# EAGLE design magpie (EAGLE 5.11)

## Sheet 1 of 2
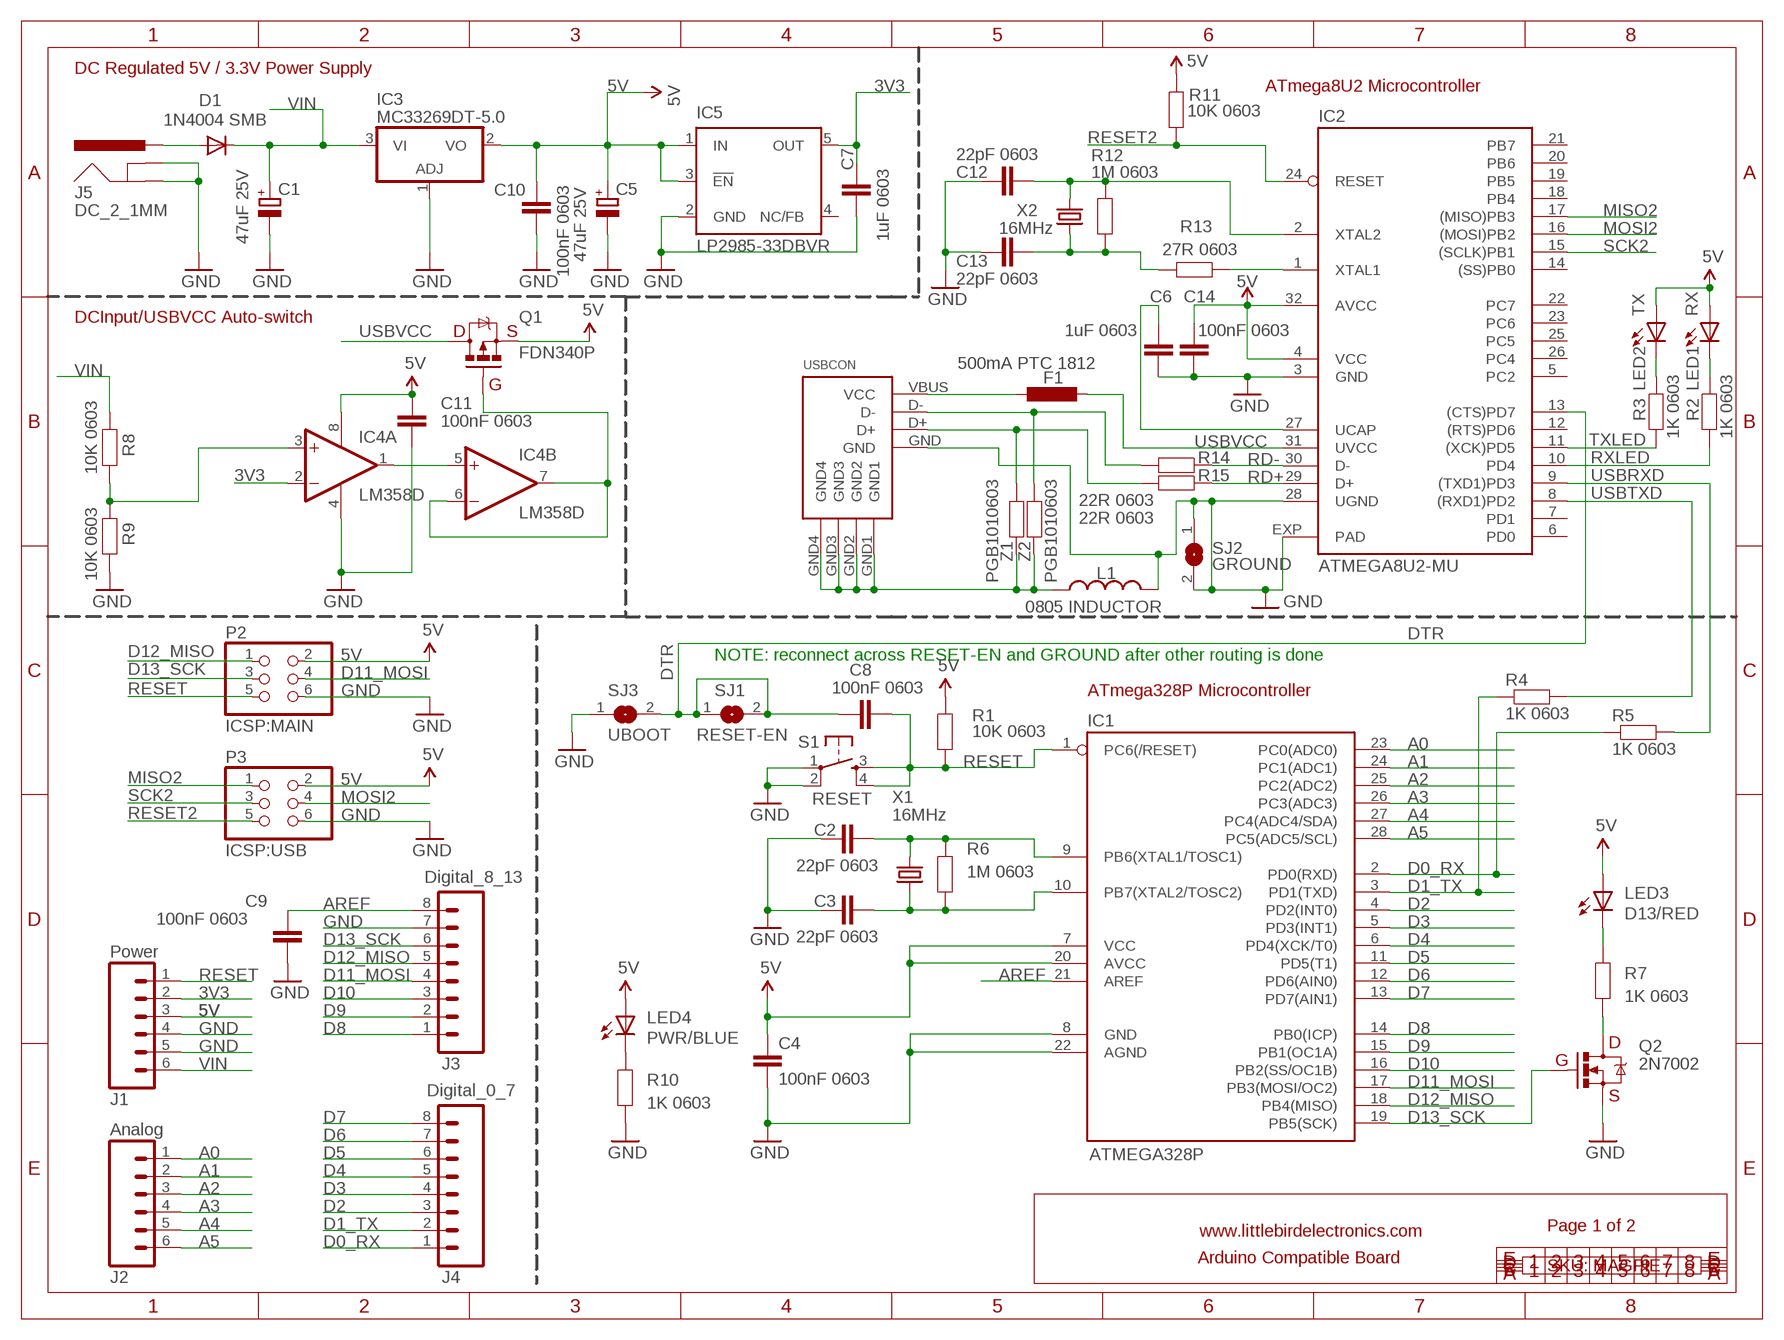
[diagram p0: schematic, sheet 1]

### Parts
C1  47uF 25V  CPOL-EUD  [PANASONIC_D]
C2  22pF 0603  CAP0603  [0603]
C3  22pF 0603  CAP0603  [0603]
C4  100nF 0603  CAP0603  [0603]
C5  47uF 25V  CPOL-EUD  [PANASONIC_D]
C6  1uF 0603  CAP0603  [0603]
C7  1uF 0603  CAP0603  [0603]
C8  100nF 0603  CAP0603  [0603]
C9  100nF 0603  CAP0603  [0603]
C10  100nF 0603  CAP0603  [0603]
C11  100nF 0603  CAP0603  [0603]
C12  22pF 0603  CAP0603  [0603]
C13  22pF 0603  CAP0603  [0603]
C14  100nF 0603  CAP0603  [0603]
D1  1N4004 SMB  DIODESMB  [SMB-DIODE]
F1  500mA PTC 1812  L-EUL1812  [L1812]
IC1  ATMEGA328P  AVR-MEGA8-P  [DIL28-3]
IC2  ATMEGA8U2-MU  ATMEL_ATMEGA8U2-MUQFN  [ATMEL_QFN32]
IC3  MC33269DT-5.0  MC33269D-5.0  [DPACK]
IC4  LM358D  [SO08]
IC5  LP2985-33DBVR  TEXAS_TPS77033  [TEXAS_SOT23-DBV]
J1  Power  M06SIP  [1X06]
J2  Analog  M06SIP  [1X06]
J3  Digital_8_13  M08  [1X08]
J4  Digital_0_7  M08  [1X08]
J5  DC_2_1MM  POWER_JACKPTH  [POWER_JACK_PTH]
L1  0805 INDUCTOR  INDUCTOR0805-LARGE  [0805-LARGE]
LED1  RX  LED0603  [LED-0603]
LED2  TX  LED0603  [LED-0603]
LED3  D13/RED  LED0603  [LED-0603]
LED4  PWR/BLUE  LED0603  [LED-0603]
P2  ICSP:MAIN  PINHD-2X3  [2X03]
P3  ICSP:USB  PINHD-2X3  [2X03]
Q1  FDN340P  MOSFET-PCHANNEL  [SOT23]
Q2  2N7002  MOSFET-NCHANNELSMD  [SOT23-3]
R1  10K 0603  RESISTOR0603  [0603]
R2  1K 0603  RESISTOR0603  [0603]
R3  1K 0603  RESISTOR0603  [0603]
R4  1K 0603  RESISTOR0603  [0603]
R5  1K 0603  RESISTOR0603  [0603]
R6  1M 0603  RESISTOR0603  [0603]
R7  1K 0603  RESISTOR0603  [0603]
R8  10K 0603  RESISTOR0603  [0603]
R9  10K 0603  RESISTOR0603  [0603]
R10  1K 0603  RESISTOR0603  [0603]
R11  10K 0603  RESISTOR0603  [0603]
R12  1M 0603  RESISTOR0603  [0603]
R13  27R 0603  RESISTOR0603  [0603]
R14  22R 0603  RESISTOR0603  [0603]
R15  22R 0603  RESISTOR0603  [0603]
S1  RESET  TAC_SWITCHSMD  [TACTILE_SWITCH_SMD]
SJ1  RESET-EN  SJ  [SJ]
SJ2  GROUND  SJ  [SJ]
SJ3  UBOOT  SJ  [SJ]
USBCON  CON_MOLEX_USB_MINI_BYOU_LONG  [YOU_LONG_MINI_USB_B]
X1  16MHz  CRYSTALHC49UV  [HC49U-V]
X2  16MHz  CRYSTALHC49UV  [HC49U-V]
Z1  PGB1010603  RESISTOR0603  [0603]
Z2  PGB1010603  RESISTOR0603  [0603]

### Nets
3V3: C7.2 IC4.2(A:-IN) IC5.5(OUT) J1.2
5V: C4.1 C5.+ C10.1 C11.1 C14.1 IC1.7(VCC) IC1.20(AVCC) IC2.4(VCC) IC2.32(AVCC) IC3.2(VO) IC4.8(P:V+) IC5.1(IN) IC5.3(!EN) J1.3 LED1.A LED2.A LED3.A LED4.A P2.2 P3.2 Q1.2(S) R1.2 R11.2 ; also sheet 2
A0: IC1.23(PC0(ADC0)) J2.1 ; also sheet 2
A1: IC1.24(PC1(ADC1)) J2.2 ; also sheet 2
A2: IC1.25(PC2(ADC2)) J2.3 ; also sheet 2
A3: IC1.26(PC3(ADC3)) J2.4 ; also sheet 2
A4: IC1.27(PC4(ADC4/SDA)) J2.5 ; also sheet 2
A5: IC1.28(PC5(ADC5/SCL)) J2.6 ; also sheet 2
AREF: C9.1 IC1.21(AREF) J3.8
D0_RX: IC1.2(PD0(RXD)) J4.1 R5.1 ; also sheet 2
D1_TX: IC1.3(PD1(TXD)) J4.2 R4.1 ; also sheet 2
D2: IC1.4(PD2(INT0)) J4.3 ; also sheet 2
D3: IC1.5(PD3(INT1)) J4.4 ; also sheet 2
D4: IC1.6(PD4(XCK/T0)) J4.5 ; also sheet 2
D5: IC1.11(PD5(T1)) J4.6 ; also sheet 2
D6: IC1.12(PD6(AIN0)) J4.7 ; also sheet 2
D7: IC1.13(PD7(AIN1)) J4.8 ; also sheet 2
D8: IC1.14(PB0(ICP)) J3.1 ; also sheet 2
D9: IC1.15(PB1(OC1A)) J3.2 ; also sheet 2
D10: IC1.16(PB2(SS/OC1B)) J3.3 ; also sheet 2
D11_MOSI: IC1.17(PB3(MOSI/OC2)) J3.4 P2.4 ; also sheet 2
D12_MISO: IC1.18(PB4(MISO)) J3.5 P2.1 ; also sheet 2
D13_SCK: IC1.19(PB5(SCK)) J3.6 P2.3 Q2.1(G)
DTR: C8.1 IC2.13((CTS)PD7) SJ1.1 SJ1.2 SJ3.2
GND: C1.- C2.1 C3.1 C4.2 C5.- C6.2 C7.1 C9.2 C10.2 C11.2 C12.1 C13.1 C14.2 IC1.8(GND) IC1.22(AGND) IC2.3(GND) IC2.28(UGND) IC2.EXP(PAD) IC3.1(ADJ) IC4.4(P:V-) IC5.2(GND) J1.4 J1.5 J3.7 J5.GND J5.GNDBREAK L1.2 P2.6 P3.6 Q2.2(S) R9.1 R10.1 S1.1 S1.2 SJ2.1 SJ2.2 SJ3.1 USBCON.GND ; also sheet 2
MISO2: IC2.17((MISO)PB3) P3.1
MOSI2: IC2.16((MOSI)PB2) P3.4
N$2: IC2.1(XTAL1) R13.1
N$3: L1.1 USBCON.GND1 USBCON.GND2 USBCON.GND3 USBCON.GND4 Z1.2 Z2.2
N$4: LED3.C R7.2
N$5: C2.2 IC1.9(PB6(XTAL1/TOSC1)) R6.2 X1.2
N$6: Q2.3(D) R7.1
N$7: C3.2 IC1.10(PB7(XTAL2/TOSC2)) R6.1 X1.1
N$8: D1.A J5.PWR
N$9: IC4.3(A:+IN) R8.1 R9.2
N$10: IC4.1(A:OUT) IC4.5(B:+IN)
N$11: LED1.C R2.2
N$12: IC4.6(B:-IN) IC4.7(B:OUT) Q1.1(G)
N$13: LED2.C R3.2
N$14: LED4.C R10.2
N$16: R15.2 USBCON.D+ Z1.1
N$17: R14.2 USBCON.D- Z2.1
N$113: C12.2 IC2.2(XTAL2) R12.2 X2.2
N$114: C13.2 R12.1 R13.2 X2.1
N$115: F1.1 USBCON.VBUS(VCC)
N$117: C6.1 IC2.27(UCAP)
RD+: IC2.29(D+) R15.1
RD-: IC2.30(D-) R14.1
RESET: C8.2 IC1.1(PC6(/RESET)) J1.1 P2.5 R1.1 S1.3 S1.4
RESET2: IC2.24(RESET) P3.5 R11.1
RXLED: IC2.10(PD4) R2.1
SCK2: IC2.15((SCLK)PB1) P3.3
TXLED: IC2.11((XCK)PD5) R3.1
USBRXD: IC2.9((TXD1)PD3) R5.2
USBTXD: IC2.8((RXD1)PD2) R4.2
USBVCC: F1.2 IC2.31(UVCC) Q1.3(D)
VIN: C1.+ D1.C IC3.3(VI) J1.6 R8.2
Unconnected: IC2.5(PC2) IC2.6(PD0) IC2.7(PD1) IC2.12((RTS)PD6) IC2.14((SS)PB0) IC2.18(PB4) IC2.19(PB5) IC2.20(PB6) IC2.21(PB7) IC2.22(PC7) IC2.23(PC6) IC2.25(PC5) IC2.26(PC4) IC5.4(NC/FB)

### Notes on the sheet
- DC Regulated 5V / 3.3V Power Supply
- ATmega8U2 Microcontroller
- DCInput/USBVCC Auto-switch
- D | S
- G
- NOTE: reconnect across RESET-EN and GROUND after other routing is done
- ATmega328P Microcontroller
- D
- G
- S
- Page 1 of 2
- www.littlebirdelectronics.com
- Arduino Compatible Board
- SKU: MAGPIE

## Sheet 2 of 2
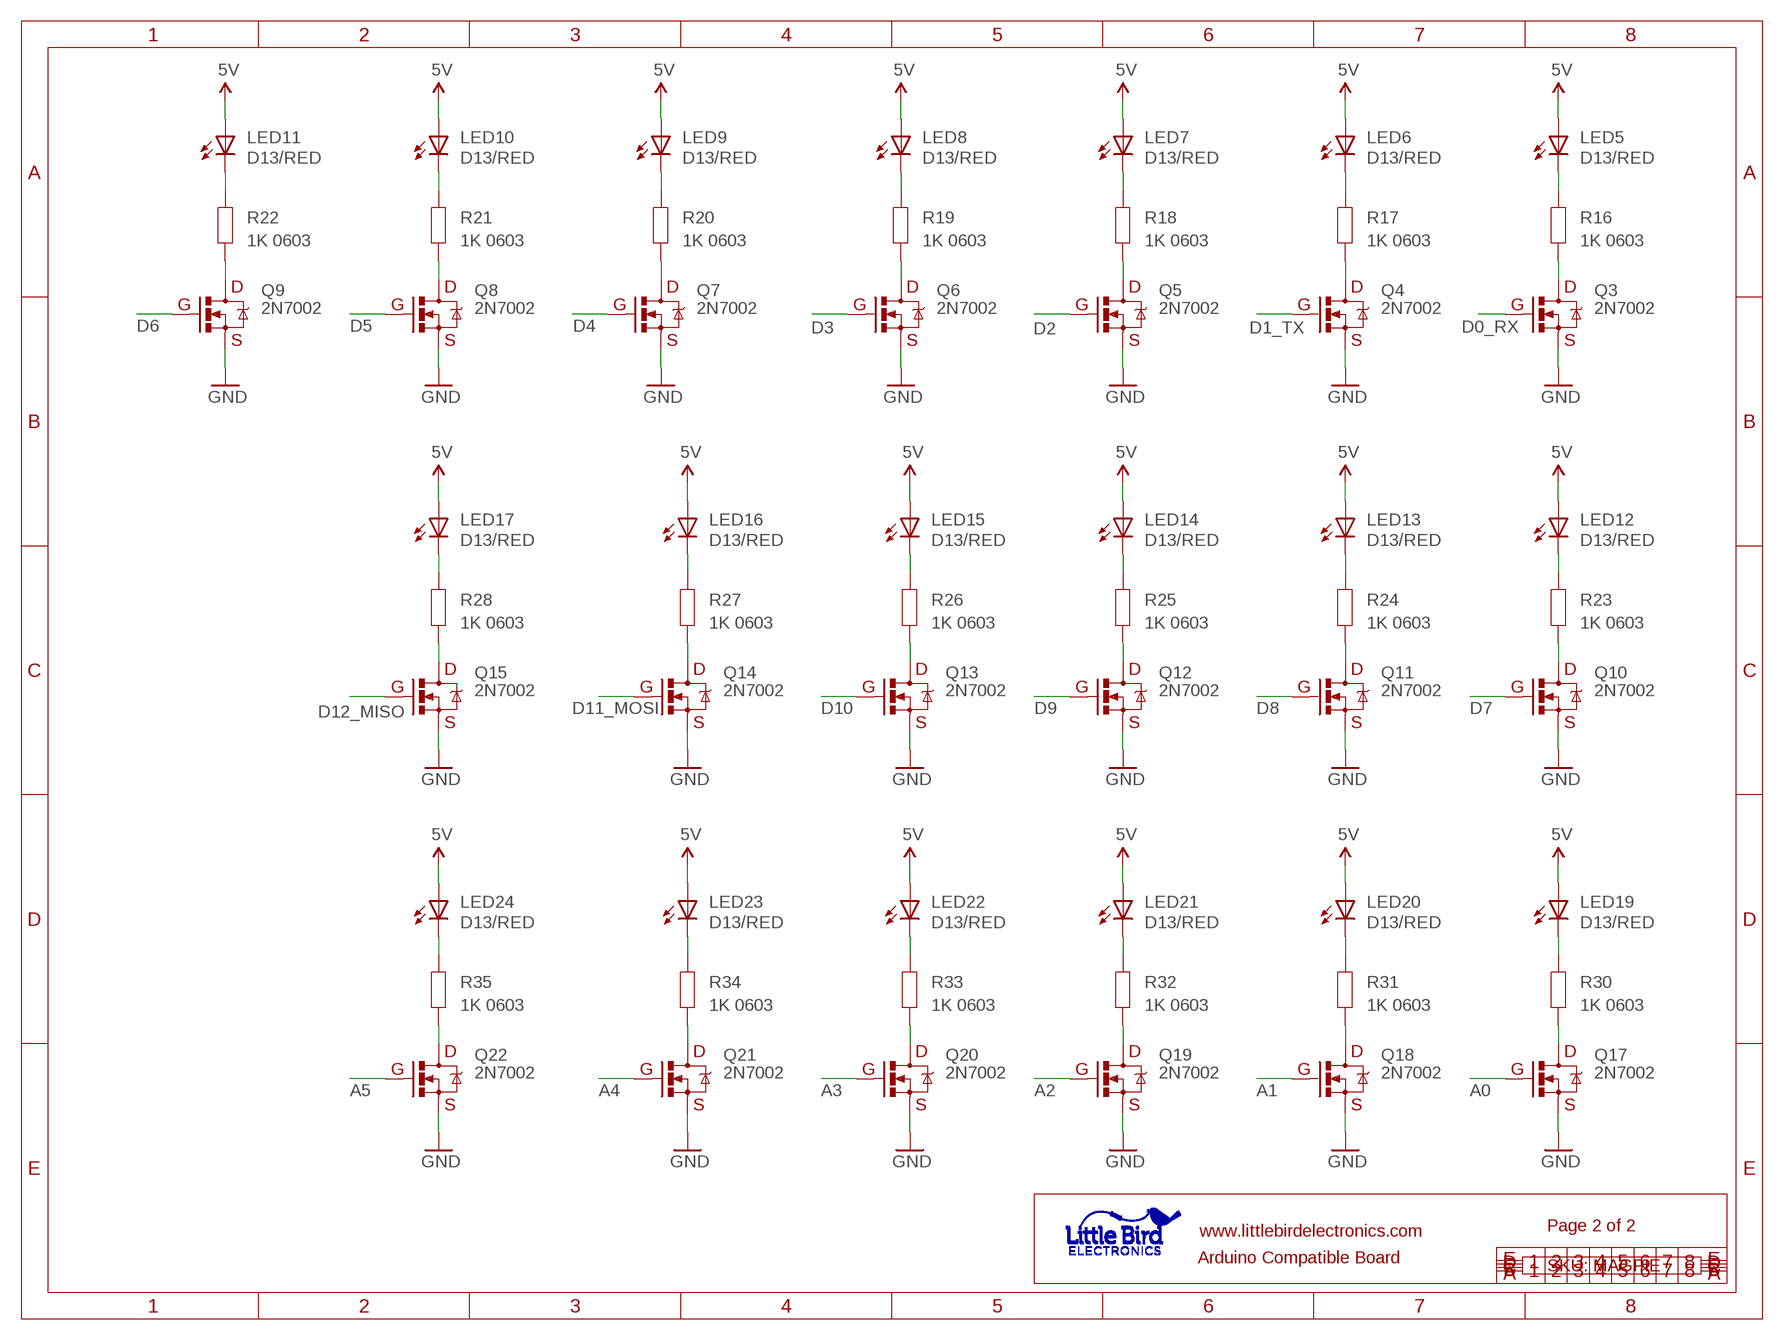
[diagram p1: schematic, sheet 2]

### Parts
LED5  D13/RED  LED0603  [LED-0603]
LED6  D13/RED  LED0603  [LED-0603]
LED7  D13/RED  LED0603  [LED-0603]
LED8  D13/RED  LED0603  [LED-0603]
LED9  D13/RED  LED0603  [LED-0603]
LED10  D13/RED  LED0603  [LED-0603]
LED11  D13/RED  LED0603  [LED-0603]
LED12  D13/RED  LED0603  [LED-0603]
LED13  D13/RED  LED0603  [LED-0603]
LED14  D13/RED  LED0603  [LED-0603]
LED15  D13/RED  LED0603  [LED-0603]
LED16  D13/RED  LED0603  [LED-0603]
LED17  D13/RED  LED0603  [LED-0603]
LED19  D13/RED  LED0603  [LED-0603]
LED20  D13/RED  LED0603  [LED-0603]
LED21  D13/RED  LED0603  [LED-0603]
LED22  D13/RED  LED0603  [LED-0603]
LED23  D13/RED  LED0603  [LED-0603]
LED24  D13/RED  LED0603  [LED-0603]
Q3  2N7002  MOSFET-NCHANNELSMD  [SOT23-3]
Q4  2N7002  MOSFET-NCHANNELSMD  [SOT23-3]
Q5  2N7002  MOSFET-NCHANNELSMD  [SOT23-3]
Q6  2N7002  MOSFET-NCHANNELSMD  [SOT23-3]
Q7  2N7002  MOSFET-NCHANNELSMD  [SOT23-3]
Q8  2N7002  MOSFET-NCHANNELSMD  [SOT23-3]
Q9  2N7002  MOSFET-NCHANNELSMD  [SOT23-3]
Q10  2N7002  MOSFET-NCHANNELSMD  [SOT23-3]
Q11  2N7002  MOSFET-NCHANNELSMD  [SOT23-3]
Q12  2N7002  MOSFET-NCHANNELSMD  [SOT23-3]
Q13  2N7002  MOSFET-NCHANNELSMD  [SOT23-3]
Q14  2N7002  MOSFET-NCHANNELSMD  [SOT23-3]
Q15  2N7002  MOSFET-NCHANNELSMD  [SOT23-3]
Q17  2N7002  MOSFET-NCHANNELSMD  [SOT23-3]
Q18  2N7002  MOSFET-NCHANNELSMD  [SOT23-3]
Q19  2N7002  MOSFET-NCHANNELSMD  [SOT23-3]
Q20  2N7002  MOSFET-NCHANNELSMD  [SOT23-3]
Q21  2N7002  MOSFET-NCHANNELSMD  [SOT23-3]
Q22  2N7002  MOSFET-NCHANNELSMD  [SOT23-3]
R16  1K 0603  RESISTOR0603  [0603]
R17  1K 0603  RESISTOR0603  [0603]
R18  1K 0603  RESISTOR0603  [0603]
R19  1K 0603  RESISTOR0603  [0603]
R20  1K 0603  RESISTOR0603  [0603]
R21  1K 0603  RESISTOR0603  [0603]
R22  1K 0603  RESISTOR0603  [0603]
R23  1K 0603  RESISTOR0603  [0603]
R24  1K 0603  RESISTOR0603  [0603]
R25  1K 0603  RESISTOR0603  [0603]
R26  1K 0603  RESISTOR0603  [0603]
R27  1K 0603  RESISTOR0603  [0603]
R28  1K 0603  RESISTOR0603  [0603]
R30  1K 0603  RESISTOR0603  [0603]
R31  1K 0603  RESISTOR0603  [0603]
R32  1K 0603  RESISTOR0603  [0603]
R33  1K 0603  RESISTOR0603  [0603]
R34  1K 0603  RESISTOR0603  [0603]
R35  1K 0603  RESISTOR0603  [0603]
U$5  LITTLEBIRDLOGO_SMALL  [LITTLEBIRD_LOGO_SMALL]

### Nets
5V: LED5.A LED6.A LED7.A LED8.A LED9.A LED10.A LED11.A LED12.A LED13.A LED14.A LED15.A LED16.A LED17.A LED19.A LED20.A LED21.A LED22.A LED23.A LED24.A ; also sheet 1
A0: Q17.1(G) ; also sheet 1
A1: Q18.1(G) ; also sheet 1
A2: Q19.1(G) ; also sheet 1
A3: Q20.1(G) ; also sheet 1
A4: Q21.1(G) ; also sheet 1
A5: Q22.1(G) ; also sheet 1
D0_RX: Q3.1(G) ; also sheet 1
D1_TX: Q4.1(G) ; also sheet 1
D2: Q5.1(G) ; also sheet 1
D3: Q6.1(G) ; also sheet 1
D4: Q7.1(G) ; also sheet 1
D5: Q8.1(G) ; also sheet 1
D6: Q9.1(G) ; also sheet 1
D7: Q10.1(G) ; also sheet 1
D8: Q11.1(G) ; also sheet 1
D9: Q12.1(G) ; also sheet 1
D10: Q13.1(G) ; also sheet 1
D11_MOSI: Q14.1(G) ; also sheet 1
D12_MISO: Q15.1(G) ; also sheet 1
GND: Q3.2(S) Q4.2(S) Q5.2(S) Q6.2(S) Q7.2(S) Q8.2(S) Q9.2(S) Q10.2(S) Q11.2(S) Q12.2(S) Q13.2(S) Q14.2(S) Q15.2(S) Q17.2(S) Q18.2(S) Q19.2(S) Q20.2(S) Q21.2(S) Q22.2(S) ; also sheet 1
N$1: LED5.C R16.2
N$54: LED6.C R17.2
N$55: Q4.3(D) R17.1
N$57: LED7.C R18.2
N$58: Q5.3(D) R18.1
N$60: LED8.C R19.2
N$61: Q6.3(D) R19.1
N$116: Q3.3(D) R16.1
N$118: LED9.C R20.2
N$119: Q7.3(D) R20.1
N$120: LED10.C R21.2
N$121: Q8.3(D) R21.1
N$122: LED11.C R22.2
N$123: Q9.3(D) R22.1
N$124: LED12.C R23.2
N$125: Q10.3(D) R23.1
N$126: LED13.C R24.2
N$127: Q11.3(D) R24.1
N$128: LED14.C R25.2
N$129: Q12.3(D) R25.1
N$130: LED15.C R26.2
N$131: Q13.3(D) R26.1
N$132: LED16.C R27.2
N$133: Q14.3(D) R27.1
N$134: LED17.C R28.2
N$135: Q15.3(D) R28.1
N$138: LED19.C R30.2
N$139: Q17.3(D) R30.1
N$140: LED20.C R31.2
N$141: Q18.3(D) R31.1
N$142: LED21.C R32.2
N$143: Q19.3(D) R32.1
N$144: LED22.C R33.2
N$145: Q20.3(D) R33.1
N$146: LED23.C R34.2
N$147: Q21.3(D) R34.1
N$148: LED24.C R35.2
N$149: Q22.3(D) R35.1

### Notes on the sheet
- D | D | D | D | D | D | D
- G | G | G | G | G | G | G
- S | S | S | S | S | S | S
- D | D | D | D | D | D
- G | G | G | G | G | G
- S | S | S | S | S | S
- D | D | D | D | D | D
- G | G | G | G | G | G
- S | S | S | S | S | S
- Page 2 of 2
- www.littlebirdelectronics.com
- Arduino Compatible Board
- SKU: MAGPIE

## Library data of the parts
C1 C5 = rcl:CPOL-EU: POLARIZED CAPACITOR, European symbol
C2-C4 C6-C14 = freetronics:CAP: Capacitor Standard 0603 ceramic capacitor, and 0.1" leaded capacitor.
D1 = freetronics:DIODE: Diode These are standard reverse protection diodes and small signal diodes. SMA package can handle up to about 1A. SOD-323 can handle about 200mA. What the SOD-323 package when ordering, there are some mfgs out there that are 5-pin packages.
F1 = rcl:L-EU: INDUCTOR, European symbol
IC1 = freetronics:AVR-MEGA8-P: MICROCONTROLLER 8 Kbytes FLASH 1 kbytes SRAM 512 bytes EEPROM USART 4-channel 10 bit ADC 2-channel 8 bit ADC
IC2 = freetronics-jon:ATMEL_ATMEGA8U2-MU
IC3 = linear:MC33269?*: Adjustable Output Low Dropout Voltage Regulator 800 mA Source: http://www.onsemi.com/pub/Collateral/MC33269-D.PDF
IC4 = linear:LM358: OP AMP also LM158; LM258; LM2904 Source: http://cache.national.com/ds/LM/LM158.pdf
IC5 = freetronics-jon:TEXAS_TPS770*: ULTRALOW-POWER 50-mA LOW-DROPOUT LINEAR REGULATORS 50-mA Low-Dropout Regulator Source: http://focus.ti.com/lit/ds/symlink/tps77001.pdf
J1 J2 = freetronics:M06: Header 6 Standard 6-pin 0.1" header. Use with straight break away headers (SKU : PRT-00116), right angle break away headers (PRT-00553), swiss pins (PRT-00743), machine pins (PRT-00117), and female headers (PRT-00115). Molex polarized connector foot print use with SKU : PRT-08094 with associated crimp pins and housings. NOTES ON THE VARIANTS LOCK and LOCK_LONGPADS... This footprint was designed to help hold the alignment of a through-hole component (i.e. 6-pin header) while soldering it into place. You may notice that each hole has been shifted either up or down by 0.005 of an inch from it's more standard position (which is a perfectly straight line). This slight alteration caused the pins (the squares in the middle) to touch the edges of the holes. Because they are alternating, it causes a "brace" to hold the component in place. 0.005 has proven to be the perfect amount of "off-center" position when using our standard breakaway headers. Although looks a little odd when you look at the bare footprint, once you have a header in there, the alteration is very hard to notice. Also, if you push a header all the way into place, it is covered up entirely on the bottom side. This idea of altering the position of holes to aid alignment will be further integrated into the Sparkfun Library for other footprints. It can help hold any component with 3 or more connection pins.
J3 J4 = freetronics:M08: Header 8 Standard 8-pin 0.1" header. Use with straight break away headers (SKU : PRT-00116), right angle break away headers (PRT-00553), swiss pins (PRT-00743), machine pins (PRT-00117), and female headers (PRT-00115).
J5 = freetronics:POWER_JACK: Power Jack This is the standard 5.5mm barrel jack for power. The PTH is the most common, proven, reliable, footprint. All others are experimental. The Slot footprint only works if the mill layer is transmitted to the PCB fab house so be warned. Spark Fun Electronics SKU : PRT-00119. Mating wall wart : TOL-00298 (and others)
L1 = freetronics-master-v1:INDUCTOR: Inductors Basic Inductor/Choke - 0603 and 1206. Footprints are not proven and vary greatly between part numbers.
LED1-LED17 LED19-LED24 = freetronics:LED: LEDs Standard schematic elements and footprints for 5mm, 3mm, 1206, and 0603 sized LEDs. 5mm - Spark Fun Electronics SKU : COM-00529 (and others)
P2 P3 = pinhead:PINHD-2X3: PIN HEADER
Q1 = freetronics-master-v1:MOSFET-PCHANNEL
Q2-Q15 Q17-Q22 = freetronics:MOSFET-NCHANNEL
R1-R28 R30-R35 Z1 Z2 = freetronics:RESISTOR: Resistor Basic schematic elements and footprints for 0603, 1206, and PTH 1/10th watt (small) resistors.
S1 = freetronics:TAC_SWITCH: Momentary Switch Button commonly used for reset or general input. Spark Fun Electronics SKU : COM-00097
SJ1-SJ3 = jumper:SJ: SMD solder JUMPER
U$5 = Monkey:LITTLEBIRDLOGO_SMALL
USBCON = Monkey:CON_MOLEX_USB_MINI_B
X1 X2 = freetronics-master-v1:CRYSTAL: Crystals Various standard crystals. Proven footprints. Spark Fun Electronics SKU : COM-00534

## Board
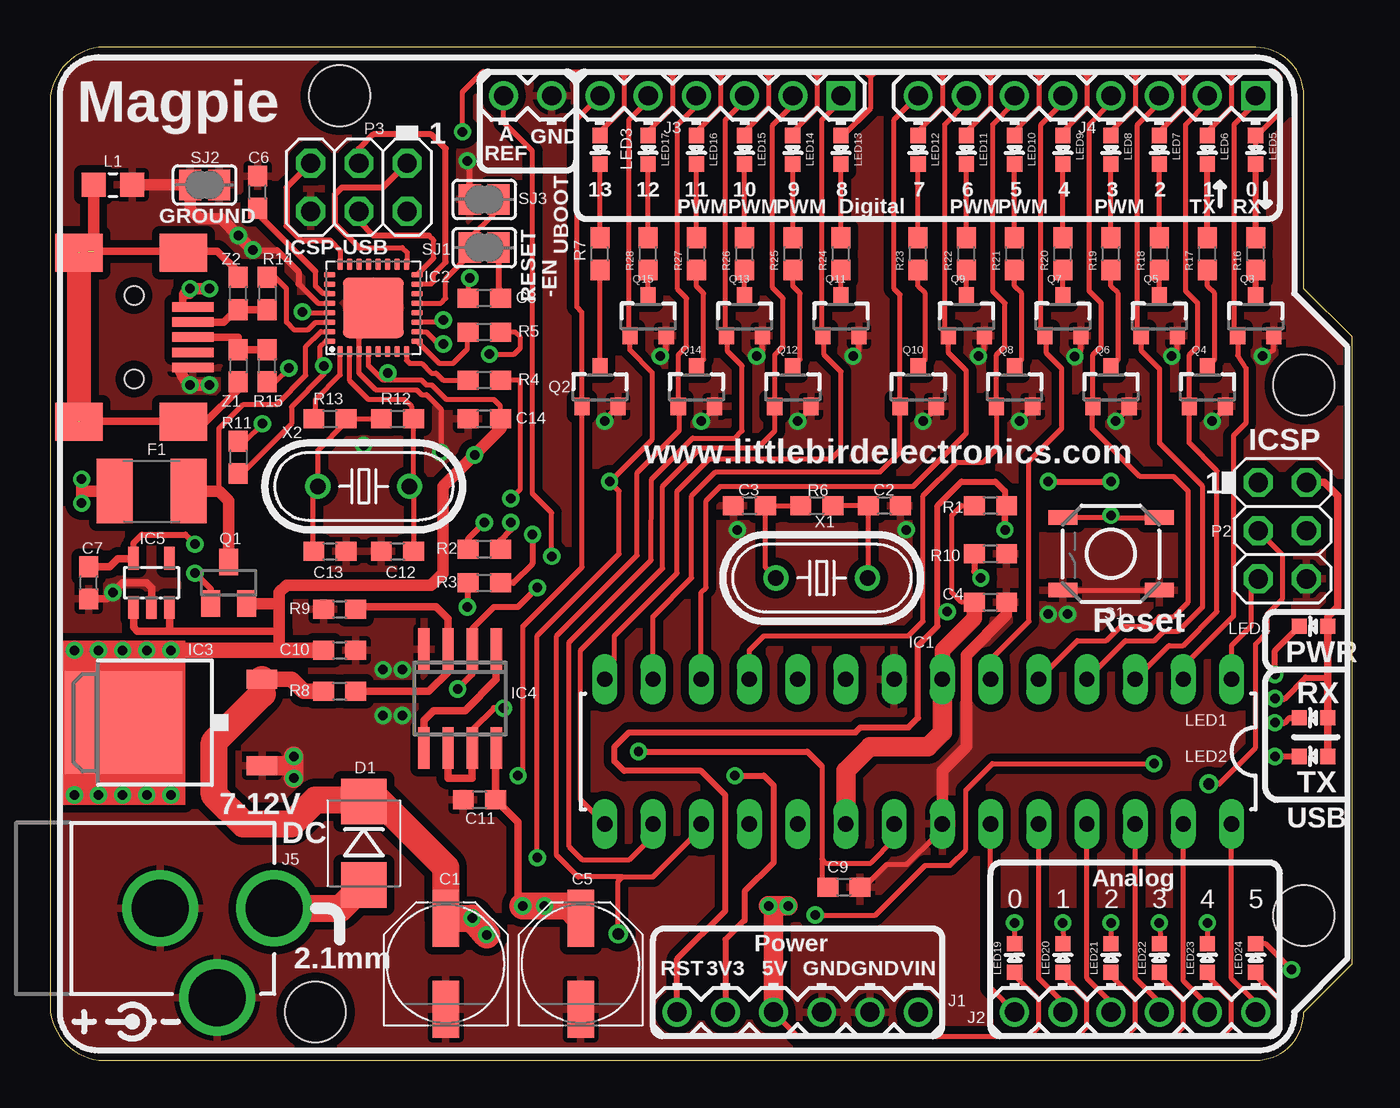
[diagram p2: board, top side]
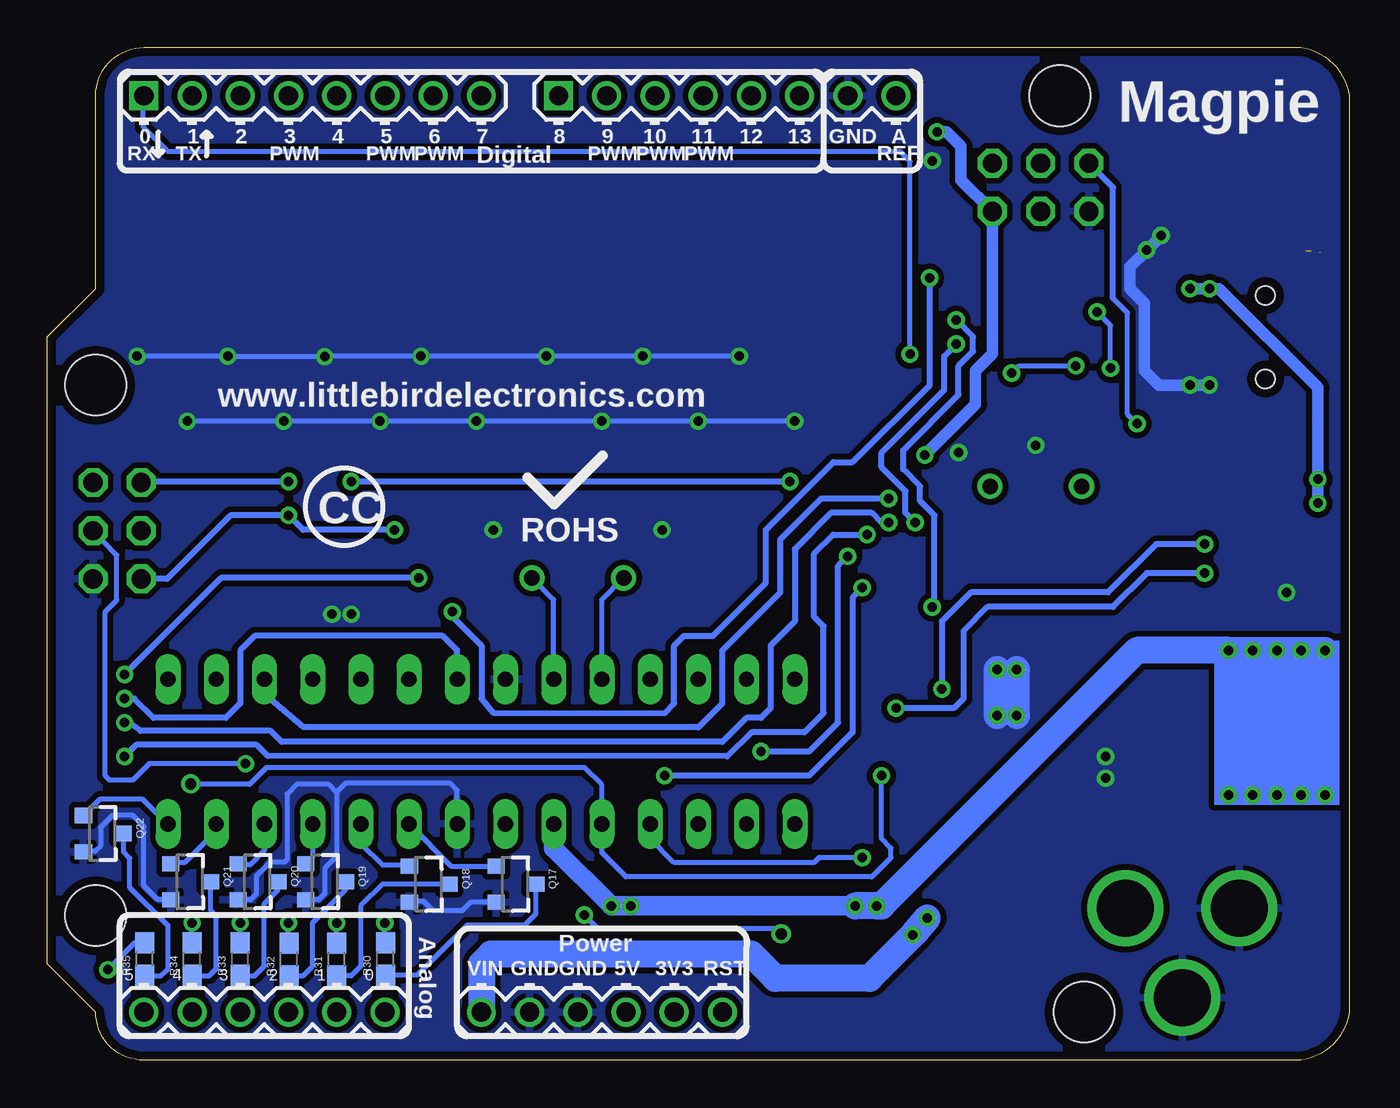
[diagram p3: board, bottom side, seen from below]

Size 68.58 x 53.34 mm. Coordinates in mm from the lower left corner, seen from the top.
Outline: 0,2.54 arc74 2.54,0 63.5,0 arc90 66.04,2.54 68.58,5.08 68.58,38.1 66.04,40.64 66.04,50.8 arc90 63.5,53.34 2.54,53.34 arc74 0,50.8 0,2.54
Copper layers (1*16): Top 0.035mm / dielectric 1.5mm / Bottom 0.035mm
Design rules "default *": minimum track width 10mil, minimum drill 18mil, track to track 10mil, track to pad 10mil, pad to pad 10mil, via to via 10mil, smd to smd 8mil, copper to edge 18mil, drill to drill 8mil, minimum pad ring 10mil, minimum via ring 8mil, stop-mask expansion 4mil, vias tented up to drill 25mil, thermal gap 10mil
Holes 3.2 mm at 66.04,35.56 66.04,7.62 15.24,50.8 13.97,2.54

### Footprints (pad centres in the part's own frame; a part is rotated, then mirrored left to right if it is on the bottom)
PANASONIC_D = smd 3 x 1.4: + 2.4,0; - -2.4,0
0603 = smd 1.1 x 1: 1 -0.85,0; 2 0.85,0
SMB-DIODE = smd 2.4 x 2.4: A 2.2,0; C -2.2,0
L1812 = smd 1.9 x 3.4: 1 -1.95,0; 2 1.95,0
DIL28-3 = drill 0.813 long: 1 -16.51,-3.81; 2 -13.97,-3.81; 3 -11.43,-3.81; 4 -8.89,-3.81; 5 -6.35,-3.81; 6 -3.81,-3.81; 7 -1.27,-3.81; 8 1.27,-3.81; 9 3.81,-3.81; 10 6.35,-3.81; 11 8.89,-3.81; 12 11.43,-3.81; 13 13.97,-3.81; 14 16.51,-3.81; 15 16.51,3.81; 16 13.97,3.81; 17 11.43,3.81; 18 8.89,3.81; 19 6.35,3.81; 20 3.81,3.81; 21 1.27,3.81; 22 -1.27,3.81; 23 -3.81,3.81; 24 -6.35,3.81; 25 -8.89,3.81; 26 -11.43,3.81; 27 -13.97,3.81; 28 -16.51,3.81
ATMEL_QFN32 = smd 0.6 x 0.3: 1 -2.3,1.75; 2 -2.3,1.25; 3 -2.3,0.75; 4 -2.3,0.25; 5 -2.3,-0.25; 6 -2.3,-0.75; 7 -2.3,-1.25; 8 -2.3,-1.75; 17 2.3,-1.75; 18 2.3,-1.25; 19 2.3,-0.75; 20 2.3,-0.25; 21 2.3,0.25; 22 2.3,0.75; 23 2.3,1.25; 24 2.3,1.75 | smd 0.3 x 0.6: 9 -1.75,-2.3; 10 -1.25,-2.3; 11 -0.75,-2.3; 12 -0.25,-2.3; 13 0.25,-2.3; 14 0.75,-2.3; 15 1.25,-2.3; 16 1.75,-2.3; 25 1.75,2.3; 26 1.25,2.3; 27 0.75,2.3; 28 0.25,2.3; 29 -0.25,2.3; 30 -0.75,2.3; 31 -1.25,2.3; 32 -1.75,2.3 | smd 3.2 x 3.2: EXP 0,0
DPACK = smd 1 x 1.6: 1 -2.28,-4.8; 3 2.28,-4.8 | smd 5.4 x 6.2: 2 0,2.5
SO08 = smd 0.6 x 2.2: 1 -1.905,-2.6; 2 -0.635,-2.6; 3 0.635,-2.6; 4 1.905,-2.6; 5 1.905,2.6; 6 0.635,2.6; 7 -0.635,2.6; 8 -1.905,2.6
TEXAS_SOT23-DBV = smd 0.55 x 1.2: 1 -0.95,-1.3; 2 0,-1.3; 3 0.95,-1.3; 4 0.95,1.3; 5 -0.95,1.3
1X06 = drill 1.016 round: 1 0,0; 2 2.54,0; 3 5.08,0; 4 7.62,0; 5 10.16,0; 6 12.7,0
1X08 = drill 1.016 square: 1 0,0 | drill 1.016 round: 2 2.54,0; 3 5.08,0; 4 7.62,0; 5 10.16,0; 6 12.7,0; 7 15.24,0; 8 17.78,0
POWER_JACK_PTH = drill 2.997 round: GND 0,7.7; GNDBREAK 4.7,10.7; PWR 0,13.7
0805-LARGE = smd 1.27 x 1.27: 1 -1.016,0; 2 1.016,0
LED-0603 = smd 0.8 x 0.8: A 0,-0.75; C 0,0.75
2X03 = drill 1.016 octagon: 1 -2.54,-1.27; 2 -2.54,1.27; 3 0,-1.27; 4 0,1.27; 5 2.54,-1.27; 6 2.54,1.27
SOT23 = smd 1 x 1.4: 1 -0.95,-1.1; 2 0.95,-1.1; 3 0,1.1
SOT23-3 = smd 0.8 x 0.9: 1 -0.95,-1; 2 0.95,-1; 3 0,1.1
TACTILE_SWITCH_SMD = smd 1.524 x 0.762: 1 -2.54,1.905; 2 2.54,1.905; 3 -2.54,-1.905; 4 2.54,-1.905
SJ = smd 1.168 x 1.6: 1 -0.762,0; 2 0.762,0
YOU_LONG_MINI_USB_B = smd 0.5 x 2.2: D+ 4.45,6; D- 3.65,6; GND 6.05,6; ID 5.25,6; VBUS 2.85,6 | smd 2 x 2.5: GND1 8.9,0; GND2 8.9,5.5; GND3 0,0; GND4 0,5.5 | hole 1: 2.25,2.9; 6.65,2.9
HC49U-V = drill 0.813 round: 1 -2.413,0; 2 2.413,0

### Placement (x,y rotation side)
C1  20.83,5.08 90 top
C2  43.94,29.21 180 top
C3  36.83,29.21 0 top
C4  49.53,24.13 0 top
C5  27.94,5.08 90 top
C6  10.92,45.72 90 top
C7  2.03,25.15 90 top
C8  22.86,40.13 180 top
C9  41.81,9.12 0 top
C10  15.24,21.59 0 top
C11  22.61,13.72 180 top
C12  18.29,26.8 0 top
C13  14.73,26.8 180 top
C14  22.86,33.78 180 top
D1  16.51,11.43 270 top
F1  5.33,29.97 0 top
IC1  45.72,16.26 180 top
IC2  17.02,39.62 90 top
IC3  6.35,17.78 90 top
IC4  21.59,19.05 180 top
IC5  5.33,25.15 0 top
J1  33.02,2.54 0 top
J2  50.8,2.54 0 top
J3  41.66,50.8 180 top
J4  63.5,50.8 180 top
J5  -1.91,8 270 top
L1  3.3,46.1 0 top
LED1  66.55,18.03 90 top
LED2  66.55,16 90 top
LED3  28.96,47.96 180 top
LED4  66.55,22.86 90 top
LED5  63.5,47.96 180 top
LED6  60.96,47.96 180 top
LED7  58.42,47.96 180 top
LED8  55.88,47.96 180 top
LED9  53.34,47.96 180 top
LED10  50.8,47.96 180 top
LED11  48.26,47.96 180 top
LED12  45.72,47.96 180 top
LED13  41.66,47.96 180 top
LED14  39.12,47.96 180 top
LED15  36.58,47.96 180 top
LED16  34.04,47.96 180 top
LED17  31.5,47.96 180 top
LED19  50.8,5.38 0 top
LED20  53.34,5.38 0 top
LED21  55.88,5.38 0 top
LED22  58.42,5.38 0 top
LED23  60.96,5.38 0 top
LED24  63.5,5.38 0 top
P2  64.91,27.89 270 top
P3  16.26,45.97 180 top
Q1  9.4,25.15 0 top
Q2  28.96,35.43 0 top
Q3  63.5,39.17 0 top
Q4  60.96,35.43 0 top
Q5  58.42,39.17 0 top
Q6  55.88,35.43 0 top
Q7  53.34,39.17 0 top
Q8  50.8,35.43 0 top
Q9  48.26,39.17 0 top
Q10  45.72,35.43 0 top
Q11  41.66,39.17 0 top
Q12  39.12,35.43 0 top
Q13  36.58,39.17 0 top
Q14  34.04,35.43 0 top
Q15  31.5,39.17 0 top
Q17  43.95,9.27 270 bottom
Q18  48.51,9.27 270 bottom
Q19  53.98,9.4 270 bottom
Q20  57.53,9.4 270 bottom
Q21  61.09,9.4 270 bottom
Q22  65.68,11.94 270 bottom
R1  49.53,29.21 180 top
R2  22.86,26.92 0 top
R3  22.86,25.15 0 top
R4  22.86,35.81 180 top
R5  22.86,38.35 180 top
R6  40.39,29.21 0 top
R7  28.96,42.47 90 top
R8  15.24,19.43 180 top
R9  15.24,23.75 0 top
R10  49.53,26.67 180 top
R11  9.91,31.75 270 top
R12  18.29,33.78 0 top
R13  14.73,33.78 0 top
R14  11.43,40.39 270 top
R15  11.43,36.58 90 top
R16  63.5,42.47 90 top
R17  60.96,42.47 90 top
R18  58.42,42.47 90 top
R19  55.88,42.47 90 top
R20  53.34,42.47 90 top
R21  50.8,42.47 90 top
R22  48.26,42.47 90 top
R23  45.72,42.47 90 top
R24  41.66,42.47 90 top
R25  39.12,42.47 90 top
R26  36.58,42.47 90 top
R27  34.04,42.47 90 top
R28  31.5,42.47 90 top
R30  50.77,5.33 90 bottom
R31  53.34,5.31 90 bottom
R32  55.85,5.31 90 bottom
R33  58.42,5.33 90 bottom
R34  60.96,5.33 90 bottom
R35  63.45,5.33 90 bottom
S1  55.88,26.67 180 top
SJ1  22.86,42.8 0 top
SJ2  8.13,46.1 0 top
SJ3  22.86,45.34 0 top
U$5  53.31,37.62 0 bottom
USBCON  1.51,42.53 270 top
X1  40.64,25.4 0 top
X2  16.51,30.23 0 top
Z1  9.91,36.58 270 top
Z2  9.91,40.39 90 top

### Tracks (layer width: path | path; a pad name or v marks a point on that pad's centre or on a via)
3V3  (via drill 0.5)
  Top 0.305: J1.2 35.56,6.35 36.58,7.37 36.58,8.89 38.1,10.41 38.1,14.48 37.59,14.99 v36.07,14.99 | v25.65,24.89 24.64,23.88 23.37,23.88 22.23,22.73 IC4.2 22.23,20.32 v21.46,19.56 | IC5.5 4.38,27.24 4.83,27.69 7.11,27.69 v7.62,27.18
  Top 0.406: C7.2 3.14,26 3.56,26.42 4.35,26.42 IC5.5
  Bottom 0.305: v36.07,14.99 28.45,14.99 26.16,17.27 26.16,24.38 v25.65,24.89 | v7.62,27.18 10.16,27.18 12.7,24.64 19.94,24.64 21.46,23.11 v21.46,19.56
5V  (via drill 0.5)
  Top 0.254: R1.2 48.01,29.21 47.5,28.7 47.5,24.64 48.01,24.13 C4.1 | 17.78,35.81 19.56,35.81 19.81,35.56 20.11,35.56 20.87,34.8 23.37,34.8 23.71,34.46 C14.1 23.75,33.78 | 17.78,35.81 17.53,35.81 16.77,36.57 IC2.4 | IC2.32 14.51,37.87 14.22,37.59 14.22,36.75 v14.4,36.58 14.4,36.12 12.7,34.42 12.7,33.53 10.07,30.9 R11.2 | 17.78,35.81 v17.78,36.2 | 12.06,24.13 11.98,24.05 | LED3.A 28.96,48.9 30.23,50.16 30.23,51.82 | 30.23,51.82 29.97,52.07 22.78,52.07 21.72,51 v21.72,48.9 | LED17.A 31.5,48.9 32.77,50.16 32.77,51.82 | 32.77,51.82 32.51,52.07 30.48,52.07 30.23,51.82 | LED16.A 34.04,48.9 35.31,50.16 35.31,51.82 | 35.31,51.82 35.05,52.07 33.02,52.07 32.77,51.82 | LED15.A 36.58,48.9 37.85,50.16 37.85,51.82 | 37.85,51.82 37.59,52.07 35.56,52.07 35.31,51.82 | LED14.A 39.12,48.9 40.39,50.16 40.39,51.82 | 40.39,51.82 40.13,52.07 38.1,52.07 37.85,51.82 | LED13.A 41.8,48.7 43.2,50.11 43.2,51.79 | 43.2,51.79 42.93,52.07 40.64,52.07 40.39,51.82 | LED12.A 45.72,48.9 46.99,50.16 46.99,51.82 | 46.99,51.82 46.74,52.07 43.48,52.07 43.2,51.79 | LED11.A 48.26,48.9 49.53,50.16 49.53,51.82 | 49.53,51.82 49.28,52.07 47.24,52.07 46.99,51.82 | LED10.A 50.8,48.9 52.07,50.16 52.07,51.82 | 52.07,51.82 51.82,52.07 49.78,52.07 49.53,51.82 | LED9.A 53.34,48.9 54.61,50.16 54.61,51.82 | 54.61,51.82 54.36,52.07 52.32,52.07 52.07,51.82 | LED8.A 55.88,48.9 57.15,50.16 57.15,51.82 | 57.15,51.82 56.9,52.07 54.86,52.07 54.61,51.82 | LED7.A 58.42,48.9 59.69,50.16 59.69,51.82 | 59.69,51.82 59.44,52.07 57.4,52.07 57.15,51.82 | LED6.A 60.96,48.9 62.23,50.16 62.23,51.82 | 62.23,51.82 61.98,52.07 59.94,52.07 59.69,51.82 | 63.5,48.64 LED5.A
  Top 0.254: 63.5,48.64 63.5,48.26 | 63.5,48.64 64.77,49.91 64.77,51.82 64.52,52.07 62.48,52.07 62.23,51.82 | LED24.A 63.5,4.45 64.77,3.17 64.77,1.78 64.26,1.27 61.72,1.27 | 51.56,1.27 39.37,1.27 J1.3 | 51.56,1.27 54.1,1.27 | 54.1,1.27 56.64,1.27 | 56.64,1.27 59.18,1.27 | 59.18,1.27 61.72,1.27 | LED23.A 60.96,4.45 62.23,3.17 62.23,1.78 61.72,1.27 | LED22.A 58.42,4.45 59.69,3.17 59.69,1.78 59.18,1.27 | LED21.A 55.88,4.45 57.15,3.17 57.15,1.78 56.64,1.27 | LED20.A 53.34,4.45 54.61,3.17 54.61,1.78 54.1,1.27 | LED19.A 50.8,4.45 52.07,3.17 52.07,1.78 51.56,1.27
  Top 0.305: 67.3,20.15 66.12,20.15 65.02,19.05 v64.52,19.05
  Top 0.406: IC4.8 23.46,16.41 C11.1 24.64,12.53 24.64,8.38 v24.89,8.13 | LED2.A LED1.A 67.3,20.15 LED4.A 67.3,23.36 67.82,23.88 67.82,29.72 67.11,30.43 P2.2 | IC5.1 4.38,22.79 4.57,22.61 6.22,22.61 | 12.06,22.61 6.22,22.61 | IC5.3 6.28,22.67 6.22,22.61
  Top 0.61: 23.75,33.78 23.75,33.27 v22.35,31.88 20.7,30.23 20.7,25.65 20.07,25.02 12.45,25.02 12.06,24.64 12.06,24.13 12.06,22.61 12.06,21.59 | 11.98,24.05 Q1.2
  Top 0.813: v5.08,21.59 v6.35,21.59 12.06,21.59 C10.1 | IC1.7 46.99,21.59 48.68,23.28 C4.1
  Top 1.016: IC3.2 3.85,18.07 5.08,19.3 v5.08,21.59 | 38.1,8.13 J1.3 | v37.85,8.13 38.1,8.13 | v38.86,8.13 38.1,8.13 | IC1.20 41.91,15.24 43.18,16.51 46.23,16.51 46.99,17.27 IC1.7
  Top 1.422: C5.+ 27.29,8.13 v24.89,8.13
  Bottom 0.254: v14.4,36.58 17.4,36.58 v17.78,36.2
  Bottom 0.305: v64.52,19.05 64.01,19.05 62.99,18.03 59.18,18.03 58.42,18.8 58.42,21.59 57.66,22.35 47.75,22.35 46.99,21.59 IC1.7
  Bottom 0.61: v21.72,48.9 21.21,48.9 20.45,48.13 20.45,46.35 P3.2 18.8,37.21 19.68,36.32 19.68,34.54 v22.35,31.88
  Bottom 1.016: IC1.20 41.91,11.18 v38.86,8.13 v37.85,8.13 v26.04,8.13
  Bottom 1.422: v26.04,8.13 v24.89,8.13 24.64,8.13 11.18,21.59 v6.35,21.59 1.27,21.59
A0
  Top 0.254: IC1.23 49.53,3.81 J2.1
  Bottom 0.254: Q17.1 47.3,10.22 IC1.23
A1
  Top 0.254: J2.2 53.34,3.05 52.07,4.32 IC1.24
  Bottom 0.254: IC1.24 52.07,11.43 50.93,10.29 49.58,10.29 Q18.1
A2
  Top 0.254: J2.3 55.88,3.05 54.61,4.32 IC1.25
  Bottom 0.254: IC1.25 54.61,10.71 Q19.1
A3
  Top 0.254: J2.4 58.42,3.05 57.15,4.32 IC1.26
  Bottom 0.254: IC1.26 57.15,11.05 57.91,10.29 58.47,10.29 Q20.1
A4
  Top 0.254: J2.5 60.96,2.92 59.69,4.19 IC1.27
  Bottom 0.254: IC1.27 59.69,12.06 61.34,10.41 62.02,10.41 Q21.1
A5
  Top 0.254: IC1.28 62.23,4.32 63.5,3.05 J2.6
  Bottom 0.254: IC1.28 62.48,12.7 62.51,12.7 63.55,13.74 65.83,13.74 Q22.1
AREF  (via drill 0.5)
  Top 0.254: J3.8 23.88,49.4 25.4,47.88 25.4,29.84 26.42,28.83 v26.42,26.54 | 40.64,15.49 40.64,10.59 | 40.64,10.59 40.64,9.44 C9.1 | IC1.21 44.45,11.61 43.23,10.39 40.84,10.39 40.64,10.59
  Top 0.305: 40.64,15.49 39.88,16.26 v30.99,16.26
  Bottom 0.305: v30.99,16.26 28.45,16.26 26.92,17.78 26.92,26.04 v26.42,26.54
D0_RX  (via drill 0.5)
  Top 0.254: IC1.2 59.69,20.75 62.33,23.39 62.33,32.89 62.99,33.55 62.99,36.45 62.56,37.11 62.56,38.16 Q3.1 | 62.31,38.05 62.39,38.05 Q3.1 | J4.1 63.5,50.42 62.36,49.28 62.36,38.36 Q3.1 | R5.1 24.49,38.35 24.77,38.08 24.77,37.52 24.43,37.19 v23.14,37.19
  Bottom 0.254: v23.14,37.19 23.14,47.35 23.65,47.85 62.23,47.85 63.52,49.15 63.52,50.77 J4.1
D1_TX  (via drill 0.5)
  Top 0.254: IC1.3 58.93,21.84 59.69,21.84 61.47,23.62 61.47,31.04 59.99,32.51 59.99,34.42 Q4.1 60.01,37.15 60.45,37.59 60.45,39.88 59.82,40.51 59.82,49.28 60.96,50.42 J4.2 | v24.26,29.59 24.77,30.1 24.77,35.81 R4.1
  Bottom 0.305: v24.26,29.59 27.81,29.59 29.97,27.43 29.97,24.64 33.02,21.59 33.02,18.8 34.29,17.53 55.09,17.55 57.15,19.3 IC1.3
D2
  Top 0.254: IC1.4 56.64,22.1 58.17,22.1 58.67,22.61 59.44,22.61 60.71,23.88 60.71,30.23 58.45,32.49 58.45,36.4 57.48,37.36 57.48,38.16 Q5.1 | Q5.1 57.15,38.49 | J4.3 58.42,50.42 57.28,49.28 57.28,38.36 Q5.1
D3
  Top 0.254: IC1.5 54.1,22.1 55.63,22.1 56.39,22.86 57.91,22.86 58.42,23.37 59.18,23.37 59.94,24.13 59.94,29.97 59.18,30.73 57.4,30.73 54.89,33.25 54.89,34.39 Q6.1 54.93,37.15 55.37,37.59 55.37,39.88 54.74,40.51 54.74,49.28 55.88,50.42 J4.4
D4
  Top 0.254: IC1.6 49.53,21.08 51.56,23.11 51.56,31.55 53.29,33.27 53.29,36.42 52.48,37.24 52.48,38.08 Q7.1 52.2,38.36 52.2,49.28 53.34,50.42 J4.5
D5
  Top 0.254: IC1.11 36.83,21.59 37.59,22.35 45.21,22.35 45.97,23.11 45.97,29.72 47.75,31.5 49.15,31.5 49.86,32.21 Q8.1 49.85,37.15 50.29,37.59 50.29,39.88 49.66,40.51 49.66,49.28 50.8,50.42 J4.6
D6
  Top 0.254: IC1.12 34.29,24.64 34.54,24.89 34.54,29.46 35.31,30.23 45.47,30.23 48.26,33.02 48.26,36.32 47.32,37.26 47.32,38.16 Q9.1 | Q9.1 46.99,38.49 | J4.7 48.26,50.42 47.12,49.28 47.12,38.36 Q9.1
D7
  Top 0.254: IC1.13 31.75,23.37 33.78,25.4 33.78,29.72 35.05,30.99 43.71,30.99 44.76,32.03 44.76,34.42 Q10.1 44.77,40.32 44.45,40.64 44.45,49.53 J4.8
D8
  Top 0.254: IC1.14 29.21,20.57 29.72,21.08 29.72,22.35 33.02,25.65 33.02,29.97 34.72,31.67 41.15,31.67 41.66,32.18 41.66,36.27 40.77,37.16 40.77,38.11 Q11.1 40.64,38.23 40.64,49.53 41.66,50.55 J3.1
D9
  Top 0.254: IC1.15 27.94,13.72 27.94,21.59 32.26,25.91 32.26,30.23 34.29,32.26 37.29,32.26 38.18,33.15 Q12.1 38.17,37.15 38.61,37.59 38.61,40.13 38.05,40.69 38.05,49.25 39.01,50.22 39.01,50.7 J3.2
D10
  Top 0.254: J3.3 36.58,50.55 35.56,49.53 35.56,38.23 Q13.1 35.69,38.11 35.69,37.34 36.45,36.58 36.45,33.15 36.07,32.77 33.83,32.77 31.67,30.61 31.65,26.34 27.33,22.02 27.33,11.25 28.02,10.57 30.5,10.57 31.75,11.81 IC1.16
D11_MOSI  (via drill 0.5, 0.6)
  Top 0.254: 33.96,50.72 J3.4 33.98,50.75 33.98,50.22 33.05,49.28 33.05,40.62 33.53,40.13 33.53,37.59 33.09,37.15 Q14.1 33.15,34.37 33.15,33.17 30.91,30.94 30.91,26.59 26.67,22.35 26.67,10.79 27.81,9.65 30.15,9.65 | v58.14,15.62 49.63,15.62 48.23,14.22 48.23,11.1 47.4,10.26 46.09,10.26 43.48,7.65 v40.3,7.65 | IC1.17 34.29,12.19 31.75,9.65 30.15,9.65 | 30.15,9.65 29.92,9.42 v29.92,6.66
  Bottom 0.254: P2.4 64.92,26.61 64.92,24.23 65.53,23.62 65.53,14.99 65.3,14.76 64.08,14.76 63.22,15.62 v58.14,15.62 | 30.12,6.93 39.58,6.93 v40.3,7.65
  Bottom 0.305: v29.92,6.66 30.12,6.93
D12_MISO  (via drill 0.5)
  Top 0.254: v25.65,10.67 25.65,22.35 29.97,26.67 29.97,29.97 v29.46,30.48 29.49,30.48 31.73,32.72 31.73,36.22 30.53,37.41 30.53,38.15 Q15.1 30.48,38.23 30.48,49.53 31.5,50.55 J3.5
  Top 0.305: v52.58,30.48 v55.88,30.48
  Bottom 0.254: v25.65,10.67 27.94,10.67 28.19,10.41 35.56,10.41 36.83,11.68 IC1.18
  Bottom 0.305: P2.1 63.59,30.48 v55.88,30.48 | v29.46,30.48 v52.58,30.48
D13_SCK  (via drill 0.5, 0.6)
  Top 0.254: v24.64,14.99 24.89,15.24 24.89,22.86 28.02,25.98 Q2.1 28.01,39.41 27.74,39.67 27.74,49.58 J3.6 | v61.04,14.55 61.59,14.55 63.5,16.46 63.5,21.92 64.11,22.53 64.11,23.5 64.92,24.31 64.92,26.61 P2.3
  Bottom 0.254: v24.64,14.99 24.64,11.68 24.13,11.18 24.13,10.67 25.15,9.65 38.1,9.65 39.37,10.92 IC1.19 39.37,14.5 40.28,15.42 57.05,15.42 57.94,14.53 61.01,14.53 v61.04,14.55
DTR
  Top 0.254: IC2.13 20.57,39.88 20.83,40.13 20.83,41.15 22.1,42.42 SJ1.1 22.1,43.31 23.37,44.58 23.37,45.09 SJ3.2
  Top 0.305: C8.1 23.62,40.73 SJ1.2
  Top 0.61: SJ1.1 SJ1.2
GND  (via drill 0.5)
  Top 0.254: S1.2 S1.1 | 16.26,37.34 IC2.3 | 16.26,37.34 16.26,39.62 IC2.EXP | 16.26,37.34 16.26,36.2 17.14,35.31 19.3,35.31 19.56,35.05 19.81,35.05 20.57,34.29 v20.57,32 | IC2.28 14.1,39.87 13.08,40.89 | C9.2 42.88,9.12 44.07,10.31 45.14,10.31 46.63,11.81 46.63,12.09 IC1.22 | Q14.2 34.99,34.35 v34.29,33.66 | v29.21,33.66 29.21,33.74 Q2.2 | Q12.2 40.07,34.35 v39.37,33.66 | Q10.2 46.67,34.35 v45.97,33.66 | Q8.2 51.75,34.35 v51.05,33.66 | Q6.2 56.83,34.35 v56.13,33.66 | Q4.2 61.91,34.35 v61.21,33.66 | Q5.2 59.37,37.37 v59.08,37.08 | v53.98,37.06 54.28,37.36 54.28,38.16 Q7.2 | Q3.2 64.45,37.4 v63.86,37.08 | Q9.2 49.21,37.4 v48.9,37.08 | Q11.2 42.61,37.4 v42.29,37.08 | Q13.2 37.53,37.4 v37.21,37.08 | Q15.2 32.45,37.4 v32.13,37.08
  Top 0.305: SJ3.1 22.1,47.24 v21.97,47.37 | 13.08,40.89 13.08,41.53 11.94,42.67 v10.67,42.67
  Top 0.406: IC5.2 5.33,24.89 5.08,25.15 3.81,25.15 v3.3,24.64 2.96,24.3 C7.1 | 7.07,35.85 7,36 7,36.48 USBCON.GND
  Top 0.61: C4.2 50.38,23.46 48.26,21.34 48.26,16.51 46.99,15.24 IC1.22 | 7.07,35.85 v7.37,35.56 v8.38,35.56 | v10.67,42.67 v9.91,43.43 9.02,44.32 7.87,44.32 7.37,44.83 SJ2.1 | SJ2.1 L1.2 | SJ2.1 SJ2.2 | 7,36 6.82,36.35
  Top 1.016: 12.83,15.5 v12.83,16 | 12.83,15.5 v12.83,14.86 | IC3.1 12.83,15.5
  Bottom 0.254: Q21.2 62.76,8.46 63.5,9.2 63.5,12.32 64.08,12.9 65.15,12.9 65.79,12.27 65.79,11.28 66.06,11 Q22.2 | Q19.2 54.29,8.45 53.98,8.76 53.98,10.11 53.34,10.74 53.34,14.12 | 53.34,14.12 52.88,14.58 47.35,14.58 46.99,14.22 IC1.22 | Q20.2 57.87,8.45 57.58,8.74 57.58,9.7 56.84,10.44 56.08,10.44 55.96,10.57 55.96,14.02 55.45,14.53 53.75,14.53 53.34,14.12 | v29.21,33.66 v34.29,33.66 v39.37,33.66 v45.97,33.66 v51.05,33.66 v56.13,33.66 v61.21,33.66 | v63.86,37.08 v59.08,37.08 59.05,37.06 v53.98,37.06 53.95,37.08 v48.9,37.08 v42.29,37.08 v37.21,37.08 v32.13,37.08 | Q17.2 46.29,8.32 46.74,7.87 48.26,7.87 48.77,8.38 49.45,8.38 Q18.2
  Bottom 0.61: v7.37,35.56 10.03,35.56 10.79,36.32 10.79,39.88 11.56,40.64 11.56,41.78 v10.67,42.67 v9.91,43.43
  Bottom 1.422: v18.54,18.16 v18.54,20.57 | v17.53,18.16 v17.53,20.57
  other vias: 36.2,27.94 16.51,32.38 52.58,23.5 53.59,23.5 45.09,27.94
  pour Top (isolate 0.406): -2.54,54.61 -2.54,-3.81 77.47,-3.81 77.47,-2.54 77.47,57.15 -2.54,57.15
  pour Bottom (isolate 0.305): -2.54,53.34 -3.81,53.34 -3.81,-1.27 71.12,-1.27 71.12,0 72.39,0 72.39,53.34
MISO2
  Top 0.254: IC2.17 18.8,41.95 18.8,42.55 18.54,42.8 16.26,42.8
  Top 0.305: 16.26,42.8 14.99,44.07 14.99,45.59 15.37,45.97 17.53,45.97 P3.1
MOSI2
  Top 0.254: IC2.16 20.19,42.25 20.19,43.18 19.94,43.43
  Top 0.305: 19.94,43.43 17.02,43.43 16.26,44.2 P3.4
N$1
  Top 0.305: R16.2 LED5.C
N$2
  Top 0.254: R13.1 13.97,34.38 13.97,34.8 15.27,36.1 IC2.1
N$3  (3 unrouted)
  Top 0.406: Z2.2 9.91,41.53 8.8,42.6 7.01,42.6 | Z1.2 9.91,35.31 8.16,33.6 7.01,33.6 USBCON.GND2 7.01,33.66 1.52,33.66 | 7.01,42.6 USBCON.GND4 | 7.01,42.6 2,42.6 2,43 1.52,43 1.52,42
  Top 0.61: 2.29,42.6 L1.1
  Top 1.27: 1.52,33.66 1.52,42 1.52,42.55
N$4
  Top 0.254: R7.2 LED3.C
N$5
  Top 0.254: R6.2 C2.2 43.09,25.44 X1.2
  Bottom 0.254: X1.2 41.91,24.26 IC1.9
N$6
  Top 0.254: Q2.3 R7.1
N$7
  Top 0.254: X1.1 37.68,25.95 C3.2 R6.1
  Bottom 0.254: X1.1 39.37,24.26 IC1.10
N$8
  Top 1.422: D1.A 15.28,8 J5.PWR
N$9
  Top 0.406: R8.1 19.94,19.43 20.95,20.45 IC4.3 20.95,23.24 20.32,23.88 16.26,23.88 16.22,23.91 16.22,23.96 R9.2
N$10
  Top 0.406: IC4.5 19.68,17.91 20.19,18.41 21.84,18.41 23.5,20.07 IC4.1
N$11  (via drill 0.5)
  Top 0.305: LED1.C 65.28,18.03 65.02,17.78 v64.52,17.78 | R2.2 23.71,27.39 24.26,27.94 v24.26,28.32
  Bottom 0.305: v64.52,17.78 64.26,17.78 63.68,17.35 56.82,17.35 56.24,16.76 33.02,16.76 31.75,18.03 30.99,18.03 30.48,18.54 30.48,21.84 29.21,23.11 29.21,26.92 27.3,28.83 25.15,28.83 24.64,28.32 v24.26,28.32
N$12  (via drill 0.5)
  Top 0.305: 22.16,16.45 22.23,16.38 22.23,17.4 23.37,18.54 v23.88,18.54 | Q1.1 8.45,24.83 v7.62,25.65
  Top 0.406: IC4.7 22.23,16.38 22.23,14.86 20.95,14.86 IC4.6
  Bottom 0.305: v7.62,25.65 10.67,25.65 12.45,23.88 19.05,23.88 20.32,22.61 20.32,19.05 20.83,18.54 v23.88,18.54
N$13  (via drill 0.5)
  Top 0.305: v64.52,16 LED2.C | v25.4,27.69 25.4,26.16 24.38,25.15 R3.2
  Bottom 0.305: v25.4,27.69 27.18,27.69 28.19,26.67 28.19,23.37 27.69,22.86 27.69,18.29 28.7,17.27 31.5,17.27 32.77,16 56.97,16.03 57.56,16.61 63.91,16.61 v64.52,16
N$14  (via drill 0.5)
  Top 0.305: LED4.C 64.52,21.58 v64.52,20.32 | v49.02,25.4 48.68,25.74 R10.2
  Bottom 0.305: v64.52,20.32 59.44,25.4 v49.02,25.4
N$16
  Top 0.406: R15.2 Z1.1 9.91,38.08 USBCON.D+
N$17
  Top 0.406: R14.2 Z2.1 9.82,39.54 9.14,38.86 7.51,38.86 USBCON.D-
N$54
  Top 0.305: R17.2 LED6.C
N$55
  Top 0.254: R17.1 60.96,40.77 61.34,40.39 61.34,36.91 Q4.3
N$57
  Top 0.254: R18.2 LED7.C
N$58
  Top 0.254: Q5.3 R18.1
N$60
  Top 0.254: R19.2 LED8.C
N$61
  Top 0.254: R19.1 55.88,40.77 56.26,40.39 56.26,36.91 Q6.3
N$98  (via drill 0.5)
  other vias: 6.35,13.97
N$99  (via drill 0.5)
  other vias: 5.08,13.97
N$107  (via drill 0.5)
  other vias: 3.81,13.97
N$108  (via drill 0.5)
  other vias: 2.54,13.97
N$109  (via drill 0.5)
  other vias: 3.81,21.59
N$110  (via drill 0.5)
  other vias: 2.54,21.59
N$111  (via drill 0.5)
  other vias: 1.27,21.59
N$112  (via drill 0.5)
  other vias: 1.27,13.97
N$113
  Top 0.254: C12.2 19.18,26.71 19.18,29.97 X2.2 19.14,30.7 R12.2 19.05,33.87 19.05,34.42 18.67,34.8 16.76,34.8 15.77,35.79 IC2.2
N$114
  Top 0.254: C13.2 13.84,26.71 13.84,29.97 X2.1 14.1,32.13 15.58,33.62 R13.2 R12.1
N$115  (via drill 0.5)
  Top 0.406: USBCON.VBUS 6.97,39.68 6.97,40.3 7.37,40.3 v7.37,40.64
  Top 0.61: v7.37,40.64 7.2,40.47 | v7.37,40.64 v8.38,40.64 | 1.65,29.97 F1.1 | 1.65,29.97 v1.65,30.61 | v1.65,29.34 1.65,29.97 | v7.37,40.64 7.07,40.35
  Bottom 0.61: v1.65,29.34 1.65,35.43 6.86,40.64 v7.37,40.64 v8.38,40.64
N$116
  Top 0.305: Q3.3 R16.1
N$117
  Top 0.254: 10.88,44.62 C6.1 | 13.97,41.53 13.97,40.77 14.35,40.39 14.71,40.39 IC2.27
  Top 0.305: 13.97,41.53 10.88,44.62
N$118
  Top 0.254: R20.2 LED9.C
N$119
  Top 0.254: Q7.3 R20.1
N$120
  Top 0.254: R21.2 LED10.C
N$121
  Top 0.254: R21.1 50.8,40.77 51.18,40.39 51.18,36.91 Q8.3
N$122
  Top 0.254: R22.2 LED11.C
N$123
  Top 0.254: Q9.3 R22.1
N$124
  Top 0.254: R23.2 LED12.C
N$125
  Top 0.254: R23.1 45.72,40.77 46.1,40.39 46.1,36.91 Q10.3
N$126
  Top 0.254: R24.2 LED13.C
N$127
  Top 0.254: Q11.3 R24.1
N$128
  Top 0.254: R25.2 LED14.C
N$129
  Top 0.254: R25.1 39.12,40.77 39.5,40.39 39.5,36.91 Q12.3
N$130
  Top 0.254: R26.2 LED15.C
N$131
  Top 0.254: Q13.3 R26.1
N$132
  Top 0.254: R27.2 LED16.C
N$133
  Top 0.254: R27.1 34.04,40.77 34.42,40.39 34.42,36.91 Q14.3
N$134
  Top 0.254: R28.2 LED17.C
N$135
  Top 0.254: Q15.3 R28.1
N$138  (via drill 0.5)
  Top 0.254: v50.8,7.24 LED19.C
  Bottom 0.254: v50.8,7.24 50.86,6.1 R30.2
N$139
  Bottom 0.254: 50.74,4.45 R30.1 49.1,4.48 46.47,7.11 43.43,7.11 42.85,7.69 Q17.3
N$140  (via drill 0.5)
  Top 0.254: v53.34,7.24 53.38,6.1 LED20.C
  Bottom 0.254: R31.2 v53.34,7.24
N$141
  Bottom 0.254: Q18.3 50.93,9.27 52.07,8.13 52.07,4.95 52.58,4.45 53.33,4.45 R31.1
N$142  (via drill 0.5)
  Top 0.254: v55.88,7.24 LED21.C
  Bottom 0.254: v55.88,7.24 55.92,6.1 R32.2
N$143
  Bottom 0.254: Q19.3 52.88,8.97 54.61,7.24 54.61,4.95 55.12,4.45 55.84,4.45 R32.1
N$144  (via drill 0.5)
  Top 0.254: v58.42,7.24 58.51,6.22 LED22.C
  Bottom 0.254: R33.2 v58.42,7.24
N$145
  Bottom 0.254: Q20.3 56.43,8.97 57.15,8.26 57.15,4.95 57.66,4.45 58.38,4.45 R33.1
N$146  (via drill 0.5)
  Top 0.254: v60.96,7.24 LED23.C
  Bottom 0.254: v60.96,7.24 61,6.22 R34.2
N$147
  Bottom 0.254: Q21.3 59.99,7.92 59.69,7.62 59.69,4.83 60.07,4.45 60.92,4.45 R34.1
N$148  (via drill 0.5)
  Top 0.254: 63.59,6.22 LED24.C 64.03,6.13 v65.39,4.77
  Bottom 0.254: R35.2 64,6.18 64.03,6.15 64.03,6.13 v65.39,4.77
N$149
  Bottom 0.254: R35.1 63.41,4.45 62.61,4.45 62.23,4.83 62.23,7.09 64.24,9.09 64.24,10.64 64.57,10.97 64.57,11.92 Q22.3
RD+  (via drill 0.5)
  Top 0.254: IC2.29 13.36,39.37 v13.28,39.42 | R15.1 11.85,35.73 v12.57,36.45
  Bottom 0.254: v13.28,39.42 12.57,38.71 v12.57,36.45
RD-
  Top 0.254: R14.1 11.85,41.24 12.45,40.64 12.45,38.86 12.83,38.48 13.59,38.48 13.97,38.86 14.71,38.86 IC2.30
RESET  (via drill 0.5)
  Top 0.254: IC1.1 62.23,21.84 63.25,22.86 63.25,24.96 P2.5 | 55.88,28.57 S1.4 | 55.88,28.57 S1.3 | v55.88,28.7 55.88,28.57 | 50.29,29.3 R1.1 | C8.2 22.01,41.12 v22.1,41.2
  Top 0.305: 50.29,29.3 v50.29,27.94 50.29,29.97 49.78,30.48 48.01,30.48 46.74,29.21 46.74,23.62 | 46.74,23.62 46.74,22.86 45.72,21.84 45.72,18.03 45.21,17.53 42.67,17.53 42.42,17.27 30.48,17.27 29.72,16.51 29.72,15.75 30.23,15.24 34.29,15.24 35.56,13.97 35.56,7.87 33.02,5.33 J1.1 | 46.74,23.62 v47.24,23.62
  Bottom 0.305: v50.29,27.94 55.12,27.94 v55.88,28.7 58.93,28.7 62.28,25.35 P2.5 | v47.24,23.62 47.24,23.37 45.72,21.84 45.72,19.05 45.11,18.31 36.07,18.29 35.56,18.8 35.56,21.84 35.05,22.35 33.53,22.35 30.73,25.15 30.73,27.94 27.18,31.5 26.16,31.5 22.1,35.56 v22.1,41.2
RESET2  (via drill 0.5)
  Top 0.254: 14.73,43.18 15.27,42.64 IC2.24 | R11.1 10.25,32.6 v11.18,33.53
  Top 0.305: P3.5 12.45,45.97 12.45,43.94 13.21,43.18 14.73,43.18
  Bottom 0.254: v11.18,33.53 11.68,34.04 11.68,39.37 12.45,40.13
  Bottom 0.305: 12.45,40.13 12.45,45.97 P3.5
RXLED  (via drill 0.5)
  Top 0.254: IC2.10 19.34,38.35 19.81,38.35 20.45,37.72 v20.7,37.72
  Top 0.305: R2.1 22.01,27.47 v22.86,28.32
  Bottom 0.305: v20.7,37.72 21.34,37.08 21.34,35.31 24.64,32 24.64,31.24 23.37,29.97 23.37,28.83 v22.86,28.32
SCK2
  Top 0.254: IC2.15 19.34,40.89 20.07,40.89 20.19,41.02 20.19,41.4 20.83,42.04
  Top 0.305: 20.83,42.04 20.83,48.01 20.07,48.77 17.02,48.77 16.26,48.01 P3.3
TXLED  (via drill 0.5)
  Top 0.254: IC2.11 20.57,38.86 v20.7,38.99
  Top 0.305: R3.1 22.01,24.8 21.97,24.77 v21.97,23.88
  Bottom 0.305: v21.97,23.88 21.84,24 21.84,28.7 22.61,29.46 22.61,30.23 23.5,31.11 23.5,32.13 20.57,35.05 20.57,36.58 19.81,37.34 19.81,38.1 v20.7,38.99
USBRXD
  Top 0.254: IC2.9 20.49,36.7 21.21,36.7 21.97,37.47 21.97,38.35 22.01,38.39 R5.2
USBTXD
  Top 0.254: R4.2 20.7,35.81 20.32,36.2 20.07,36.2 19.56,36.7 18.92,36.7 18.77,36.86 IC2.8
USBVCC
  Top 0.254: IC2.31 14.24,38.37 13.46,37.59 13.46,36.07 11.94,34.54 10.16,34.54 8.89,33.27 8.89,29.97
  Top 0.61: Q1.3 9.4,29.46 8.89,29.97 F1.2
VIN  (via drill 0.5)
  Top 0.813: IC3.3 12.71,20.06 13.34,19.43 R8.2
  Top 1.422: IC3.3 11.17,19.3 8.64,16.76 8.64,13.97 10.16,12.45 12.7,12.45 13.97,13.72 16.42,13.72 D1.C 17.36,13.63 20.83,10.16 C1.+ v22.24,7.48 v22.23,7.49 v22.99,6.6
  Bottom 1.422: J1.6 45.72,5.08 45.21,5.59 31.5,5.59 30.23,4.32 25.27,4.32 v22.99,6.6 v22.23,7.49
(copper drawn outside any net)
  shapes: Bottom area x1, Top area x1

### Text on the board
tPlace: Magpie | 1 | A | GND | REF | UBOOT | 13 | 12 | PWM | 11 | PWM | 10 | PWM | 9 | 8 | Digital | 7 | PWM | 6 | PWM | 5 | 4 | PWM | 3 | 2 | TX | 1 | RX | 0 | GROUND | RESET | ICSP-USB | -EN | ICSP | www.littlebirdelectronics.com | 1 | Reset | PWR | RX | TX | 7-12V | USB | DC | Analog | 0 | 1 | 2 | 3 | 4 | 5 | Power | 2.1mm | RST | 3V3 | 5V | GND | GND | VIN
bPlace: Magpie | A | GND | 13 | 12 | 11 | 10 | 9 | 8 | 7 | 6 | 5 | 4 | 3 | 2 | 1 | 0 | REF | PWM | PWM | PWM | Digital | PWM | PWM | PWM | TX | RX | www.littlebirdelectronics.com | CC | ROHS | Analog | Power | RST | 3V3 | 5V | GND | GND | VIN | 0 | 1 | 2 | 3 | 4 | 5